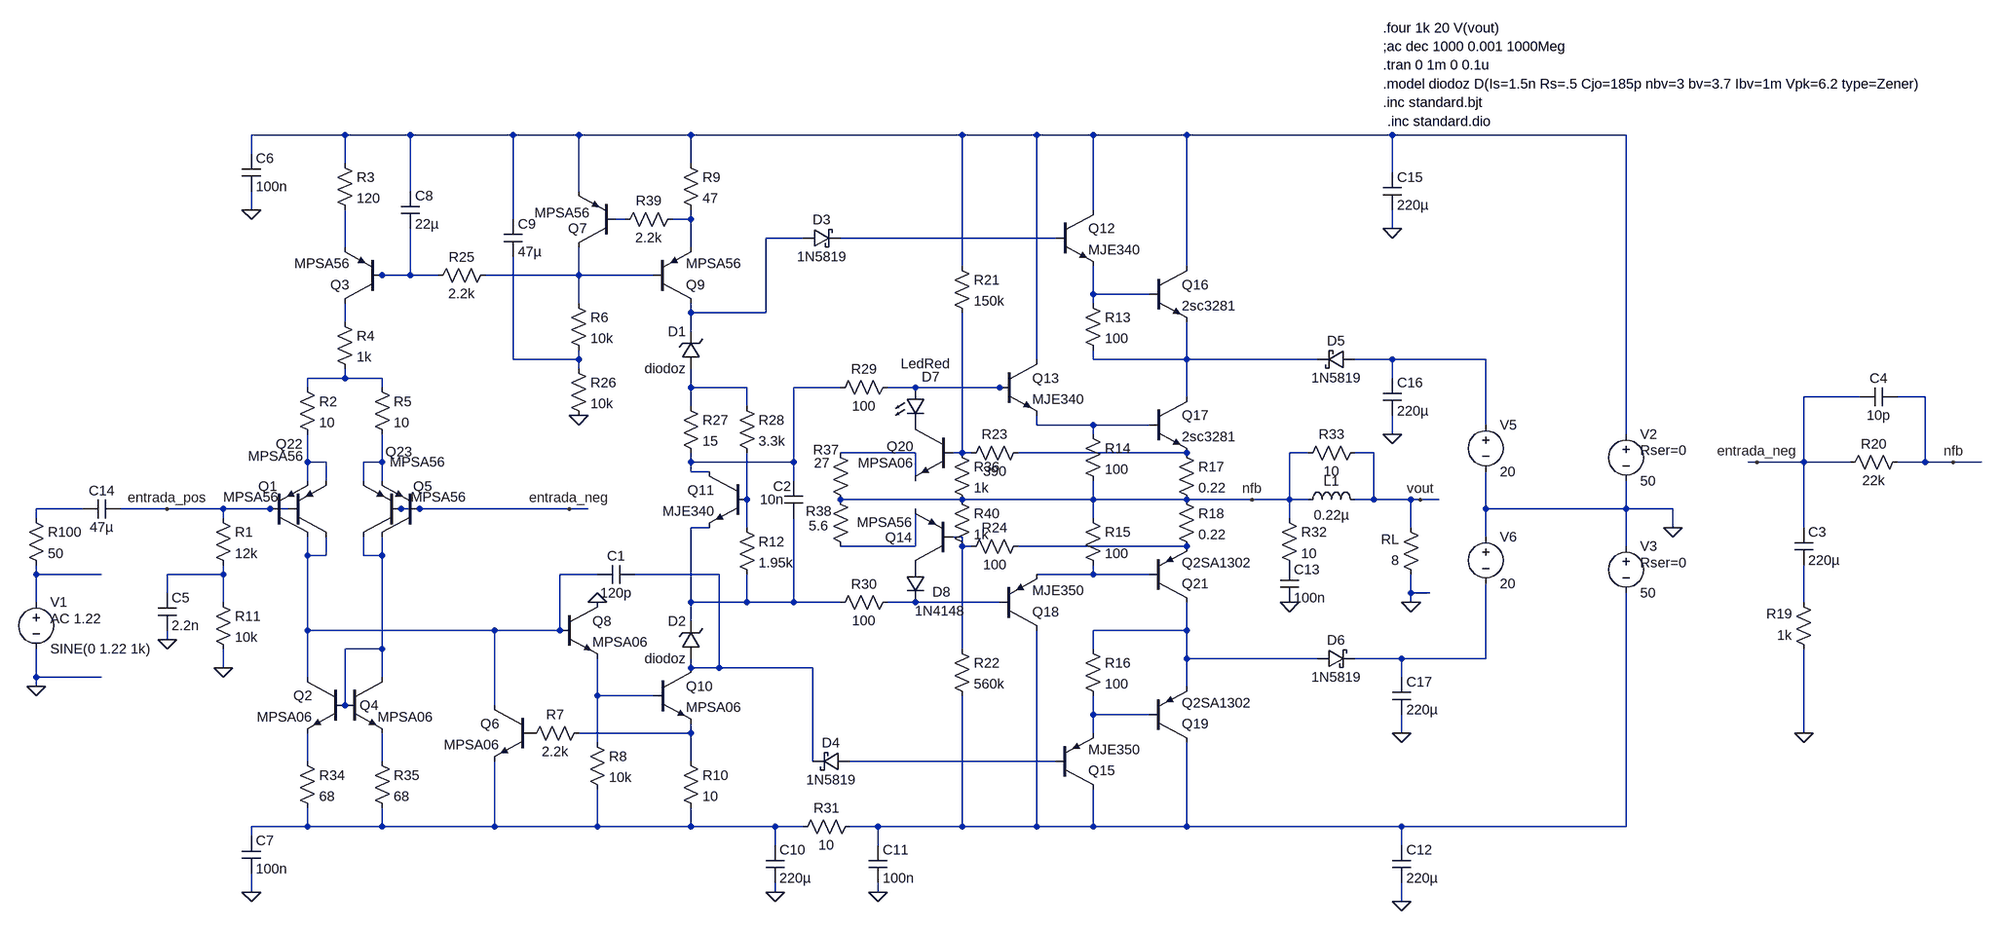
[diagram p0: schematic amplificador G - touch of fran.asc]
amplificador G - touch of fran.asc, the LTspice schematic file:
Version 4
SHEET 1 1412 756
WIRE -9488 -3552 -9648 -3552
WIRE -9376 -3552 -9488 -3552
WIRE -9200 -3552 -9376 -3552
WIRE -9088 -3552 -9200 -3552
WIRE -8896 -3552 -9088 -3552
WIRE -8432 -3552 -8896 -3552
WIRE -8304 -3552 -8432 -3552
WIRE -8208 -3552 -8304 -3552
WIRE -8048 -3552 -8208 -3552
WIRE -7696 -3552 -8048 -3552
WIRE -7296 -3552 -7696 -3552
WIRE -9648 -3520 -9648 -3552
WIRE -9488 -3504 -9488 -3552
WIRE -8896 -3504 -8896 -3552
WIRE -7696 -3488 -7696 -3552
WIRE -9376 -3456 -9376 -3552
WIRE -9088 -3456 -9088 -3552
WIRE -9648 -3424 -9648 -3456
WIRE -8208 -3424 -8208 -3552
WIRE -9200 -3408 -9200 -3552
WIRE -9008 -3408 -9024 -3408
WIRE -8896 -3408 -8896 -3424
WIRE -8896 -3408 -8928 -3408
WIRE -7696 -3392 -7696 -3424
WIRE -8704 -3376 -8768 -3376
WIRE -8272 -3376 -8640 -3376
WIRE -9488 -3360 -9488 -3424
WIRE -8896 -3360 -8896 -3408
WIRE -8432 -3328 -8432 -3552
WIRE -8048 -3328 -8048 -3552
WIRE -9424 -3312 -9440 -3312
WIRE -9376 -3312 -9376 -3392
WIRE -9376 -3312 -9424 -3312
WIRE -9328 -3312 -9376 -3312
WIRE -9088 -3312 -9088 -3360
WIRE -9088 -3312 -9248 -3312
WIRE -8960 -3312 -9088 -3312
WIRE -8208 -3280 -8208 -3328
WIRE -8112 -3280 -8208 -3280
WIRE -9088 -3264 -9088 -3312
WIRE -8208 -3264 -8208 -3280
WIRE -8896 -3248 -8896 -3264
WIRE -8768 -3248 -8768 -3376
WIRE -8768 -3248 -8896 -3248
WIRE -9488 -3232 -9488 -3264
WIRE -8896 -3216 -8896 -3248
WIRE -9200 -3168 -9200 -3344
WIRE -9088 -3168 -9088 -3184
WIRE -9088 -3168 -9200 -3168
WIRE -8304 -3168 -8304 -3552
WIRE -8208 -3168 -8208 -3184
WIRE -8048 -3168 -8048 -3232
WIRE -8048 -3168 -8208 -3168
WIRE -7824 -3168 -8048 -3168
WIRE -7696 -3168 -7760 -3168
WIRE -7536 -3168 -7696 -3168
WIRE -9088 -3152 -9088 -3168
WIRE -9488 -3136 -9488 -3152
WIRE -9488 -3136 -9552 -3136
WIRE -9424 -3136 -9488 -3136
WIRE -7696 -3136 -7696 -3168
WIRE -9552 -3120 -9552 -3136
WIRE -9424 -3120 -9424 -3136
WIRE -8896 -3120 -8896 -3152
WIRE -8800 -3120 -8896 -3120
WIRE -8640 -3120 -8720 -3120
WIRE -8512 -3120 -8560 -3120
WIRE -8368 -3120 -8512 -3120
WIRE -8352 -3120 -8368 -3120
WIRE -8048 -3104 -8048 -3168
WIRE -6896 -3104 -6992 -3104
WIRE -6784 -3104 -6832 -3104
WIRE -8896 -3088 -8896 -3120
WIRE -8800 -3088 -8800 -3120
WIRE -8304 -3056 -8304 -3072
WIRE -8208 -3056 -8304 -3056
WIRE -8112 -3056 -8208 -3056
WIRE -7536 -3056 -7536 -3168
WIRE -8208 -3040 -8208 -3056
WIRE -7696 -3040 -7696 -3072
WIRE -7296 -3040 -7296 -3552
WIRE -8512 -3008 -8640 -3008
WIRE -8432 -3008 -8432 -3248
WIRE -8432 -3008 -8448 -3008
WIRE -8416 -3008 -8432 -3008
WIRE -8048 -3008 -8336 -3008
WIRE -7840 -3008 -7872 -3008
WIRE -7728 -3008 -7760 -3008
WIRE -9552 -2992 -9552 -3040
WIRE -9520 -2992 -9552 -2992
WIRE -9424 -2992 -9424 -3040
WIRE -9424 -2992 -9456 -2992
WIRE -8896 -2992 -8896 -3008
WIRE -8720 -2992 -8720 -3120
WIRE -8720 -2992 -8896 -2992
WIRE -7072 -2992 -7088 -2992
WIRE -6992 -2992 -6992 -3104
WIRE -6992 -2992 -7072 -2992
WIRE -6912 -2992 -6992 -2992
WIRE -6784 -2992 -6784 -3104
WIRE -6784 -2992 -6832 -2992
WIRE -6736 -2992 -6784 -2992
WIRE -6688 -2992 -6736 -2992
WIRE -8896 -2976 -8896 -2992
WIRE -8864 -2976 -8896 -2976
WIRE -9552 -2960 -9552 -2992
WIRE -9520 -2960 -9520 -2992
WIRE -9456 -2960 -9456 -2992
WIRE -9424 -2960 -9424 -2992
WIRE -8720 -2960 -8720 -2992
WIRE -8512 -2960 -8512 -3008
WIRE -8800 -2928 -8800 -3008
WIRE -8432 -2928 -8640 -2928
WIRE -8208 -2928 -8208 -2960
WIRE -8208 -2928 -8432 -2928
WIRE -8048 -2928 -8208 -2928
WIRE -7936 -2928 -8048 -2928
WIRE -7872 -2928 -7872 -3008
WIRE -7872 -2928 -7936 -2928
WIRE -7840 -2928 -7872 -2928
WIRE -7728 -2928 -7728 -3008
WIRE -7728 -2928 -7760 -2928
WIRE -7664 -2928 -7728 -2928
WIRE -7648 -2928 -7664 -2928
WIRE -7616 -2928 -7648 -2928
WIRE -9936 -2912 -10016 -2912
WIRE -9792 -2912 -9872 -2912
WIRE -9696 -2912 -9792 -2912
WIRE -9616 -2912 -9696 -2912
WIRE -9584 -2912 -9616 -2912
WIRE -9392 -2912 -9408 -2912
WIRE -9360 -2912 -9392 -2912
WIRE -9104 -2912 -9360 -2912
WIRE -9072 -2912 -9104 -2912
WIRE -7536 -2912 -7536 -2976
WIRE -7296 -2912 -7296 -2960
WIRE -7296 -2912 -7536 -2912
WIRE -7216 -2912 -7296 -2912
WIRE -10016 -2896 -10016 -2912
WIRE -9696 -2896 -9696 -2912
WIRE -8208 -2896 -8208 -2928
WIRE -7872 -2896 -7872 -2928
WIRE -8864 -2880 -8896 -2880
WIRE -8800 -2880 -8800 -2928
WIRE -7664 -2880 -7664 -2928
WIRE -7216 -2880 -7216 -2912
WIRE -6992 -2880 -6992 -2992
WIRE -8432 -2864 -8448 -2864
WIRE -7536 -2864 -7536 -2912
WIRE -8512 -2848 -8512 -2912
WIRE -8512 -2848 -8640 -2848
WIRE -8432 -2848 -8432 -2864
WIRE -8416 -2848 -8432 -2848
WIRE -8048 -2848 -8336 -2848
WIRE -7296 -2848 -7296 -2912
WIRE -9552 -2832 -9552 -2864
WIRE -9520 -2832 -9520 -2864
WIRE -9520 -2832 -9552 -2832
WIRE -9456 -2832 -9456 -2864
WIRE -9424 -2832 -9424 -2864
WIRE -9424 -2832 -9456 -2832
WIRE -10016 -2800 -10016 -2816
WIRE -9904 -2800 -10016 -2800
WIRE -9696 -2800 -9696 -2816
WIRE -9696 -2800 -9792 -2800
WIRE -9056 -2800 -9120 -2800
WIRE -8848 -2800 -8992 -2800
WIRE -8208 -2800 -8208 -2816
WIRE -8208 -2800 -8304 -2800
WIRE -8112 -2800 -8208 -2800
WIRE -9792 -2768 -9792 -2800
WIRE -7664 -2768 -7664 -2800
WIRE -7632 -2768 -7664 -2768
WIRE -10016 -2752 -10016 -2800
WIRE -9696 -2752 -9696 -2800
WIRE -8896 -2752 -8896 -2880
WIRE -8800 -2752 -8800 -2800
WIRE -8800 -2752 -8896 -2752
WIRE -8720 -2752 -8720 -2896
WIRE -8720 -2752 -8800 -2752
WIRE -8640 -2752 -8720 -2752
WIRE -8512 -2752 -8560 -2752
WIRE -8368 -2752 -8512 -2752
WIRE -7664 -2752 -7664 -2768
WIRE -6992 -2752 -6992 -2816
WIRE -8896 -2720 -8896 -2752
WIRE -9552 -2704 -9552 -2832
WIRE -9232 -2704 -9552 -2704
WIRE -9120 -2704 -9120 -2800
WIRE -9120 -2704 -9232 -2704
WIRE -8048 -2704 -8048 -2752
WIRE -8048 -2704 -8208 -2704
WIRE -9792 -2688 -9792 -2704
WIRE -9424 -2672 -9424 -2832
WIRE -9424 -2672 -9488 -2672
WIRE -8432 -2672 -8432 -2848
WIRE -8208 -2672 -8208 -2704
WIRE -8048 -2656 -8048 -2704
WIRE -7824 -2656 -8048 -2656
WIRE -7680 -2656 -7760 -2656
WIRE -7536 -2656 -7536 -2784
WIRE -7536 -2656 -7680 -2656
WIRE -9696 -2640 -9696 -2672
WIRE -8896 -2640 -8896 -2656
WIRE -8848 -2640 -8848 -2800
WIRE -8848 -2640 -8896 -2640
WIRE -8688 -2640 -8848 -2640
WIRE -10016 -2624 -10016 -2672
WIRE -9904 -2624 -10016 -2624
WIRE -9552 -2624 -9552 -2704
WIRE -9424 -2624 -9424 -2672
WIRE -7680 -2624 -7680 -2656
WIRE -10016 -2608 -10016 -2624
WIRE -8048 -2608 -8048 -2656
WIRE -9056 -2592 -9056 -2656
WIRE -8960 -2592 -9056 -2592
WIRE -9488 -2576 -9488 -2672
WIRE -9232 -2576 -9232 -2704
WIRE -8208 -2560 -8208 -2592
WIRE -8112 -2560 -8208 -2560
WIRE -8896 -2528 -8896 -2544
WIRE -8896 -2528 -9088 -2528
WIRE -8208 -2528 -8208 -2560
WIRE -7680 -2528 -7680 -2560
WIRE -6992 -2528 -6992 -2672
WIRE -9056 -2512 -9056 -2592
WIRE -9552 -2480 -9552 -2528
WIRE -9424 -2480 -9424 -2528
WIRE -8896 -2480 -8896 -2528
WIRE -8688 -2480 -8688 -2640
WIRE -8272 -2480 -8624 -2480
WIRE -9552 -2368 -9552 -2400
WIRE -9552 -2368 -9648 -2368
WIRE -9424 -2368 -9424 -2400
WIRE -9424 -2368 -9552 -2368
WIRE -9232 -2368 -9232 -2480
WIRE -9232 -2368 -9424 -2368
WIRE -9056 -2368 -9056 -2432
WIRE -9056 -2368 -9232 -2368
WIRE -8896 -2368 -8896 -2400
WIRE -8896 -2368 -9056 -2368
WIRE -8752 -2368 -8896 -2368
WIRE -8704 -2368 -8752 -2368
WIRE -8576 -2368 -8624 -2368
WIRE -8432 -2368 -8432 -2592
WIRE -8432 -2368 -8576 -2368
WIRE -8304 -2368 -8304 -2704
WIRE -8304 -2368 -8432 -2368
WIRE -8208 -2368 -8208 -2432
WIRE -8208 -2368 -8304 -2368
WIRE -8048 -2368 -8048 -2512
WIRE -8048 -2368 -8208 -2368
WIRE -7680 -2368 -8048 -2368
WIRE -7296 -2368 -7296 -2768
WIRE -7296 -2368 -7680 -2368
WIRE -9648 -2352 -9648 -2368
WIRE -8752 -2336 -8752 -2368
WIRE -8576 -2336 -8576 -2368
WIRE -7680 -2336 -7680 -2368
WIRE -9648 -2256 -9648 -2288
WIRE -8752 -2256 -8752 -2272
WIRE -8576 -2256 -8576 -2272
WIRE -7680 -2240 -7680 -2272
FLAG -7216 -2880 0
FLAG -9696 -2640 0
FLAG -7664 -2752 0
FLAG -7936 -2928 nfb
FLAG -10016 -2608 0
FLAG -6992 -2528 0
FLAG -7072 -2992 entrada_neg
FLAG -9104 -2912 entrada_neg
FLAG -6736 -2992 nfb
FLAG -9792 -2912 entrada_pos
FLAG -9056 -2752 0
FLAG -9088 -3072 0
FLAG -9648 -3424 0
FLAG -7696 -3392 0
FLAG -7872 -2752 0
FLAG -8752 -2256 0
FLAG -8576 -2256 0
FLAG -9648 -2256 0
FLAG -7680 -2240 0
FLAG -7680 -2528 0
FLAG -7696 -3040 0
FLAG -9792 -2688 0
FLAG -7648 -2928 vout
SYMBOL res -9504 -3520 R0
SYMATTR InstName R3
SYMATTR Value 120
SYMBOL res -8912 -2496 R0
SYMATTR InstName R10
SYMATTR Value 10
SYMBOL res -8912 -3520 R0
SYMATTR InstName R9
SYMATTR Value 47
SYMBOL res -6816 -3008 R90
WINDOW 0 0 56 VBottom 2
WINDOW 3 32 56 VTop 2
SYMATTR InstName R20
SYMATTR Value 22k
SYMBOL res -6976 -2656 R180
WINDOW 0 36 76 Left 2
WINDOW 3 36 40 Left 2
SYMATTR InstName R19
SYMATTR Value 1k
SYMBOL res -7648 -2784 R180
WINDOW 0 36 76 Left 2
WINDOW 3 36 40 Left 2
SYMATTR InstName RL
SYMATTR Value 8
SYMBOL voltage -7296 -3056 R0
WINDOW 123 0 0 Left 2
WINDOW 39 24 44 Left 2
SYMATTR SpiceLine Rser=0
SYMATTR InstName V2
SYMATTR Value 50
SYMBOL voltage -7296 -2864 R0
WINDOW 123 0 0 Left 2
WINDOW 39 24 44 Left 2
SYMATTR SpiceLine Rser=0
SYMATTR InstName V3
SYMATTR Value 50
SYMBOL pnp -9360 -2864 R180
WINDOW 0 -21 87 Left 2
WINDOW 3 -79 68 Left 2
SYMATTR InstName Q5
SYMATTR Value MPSA56
SYMBOL pnp -9616 -2864 M180
WINDOW 0 -20 87 Left 2
WINDOW 3 -80 68 Left 2
SYMATTR InstName Q1
SYMATTR Value MPSA56
SYMBOL npn -8960 -2640 R0
SYMATTR InstName Q10
SYMATTR Value MPSA06
SYMBOL npn -8368 -3168 R0
SYMATTR InstName Q13
SYMATTR Value MJE340
SYMBOL cap -7008 -2880 R0
SYMATTR InstName C3
SYMATTR Value 220µ
SYMBOL pnp -8368 -2704 M180
SYMATTR InstName Q18
SYMATTR Value MJE350
SYMBOL npn -8800 -2976 M0
SYMATTR InstName Q11
SYMATTR Value MJE340
SYMBOL res -8816 -3104 R0
SYMATTR Value 3.3k
SYMATTR InstName R28
SYMBOL res -8816 -2896 R0
SYMATTR InstName R12
SYMATTR Value 1.95k
SYMBOL cap -8736 -2960 R0
WINDOW 0 -19 9 Left 2
WINDOW 3 -42 32 Left 2
SYMATTR InstName C2
SYMATTR Value 10n
SYMBOL voltage -10016 -2768 R0
WINDOW 123 24 44 Left 2
WINDOW 39 0 0 Left 2
SYMATTR Value2 AC 1.22
SYMATTR InstName V1
SYMATTR Value SINE(0 1.22 1k)
SYMBOL res -10032 -2912 R0
SYMATTR InstName R100
SYMATTR Value 50
SYMBOL cap -9872 -2928 R90
WINDOW 0 0 32 VBottom 2
WINDOW 3 32 32 VTop 2
SYMATTR InstName C14
SYMATTR Value 47µ
SYMBOL npn -8112 -3104 R0
SYMATTR InstName Q17
SYMATTR Value 2sc3281
SYMBOL pnp -8112 -2752 M180
SYMATTR InstName Q21
SYMATTR Value Q2SA1302
SYMBOL res -8224 -3056 R0
SYMATTR InstName R14
SYMATTR Value 100
SYMBOL res -8224 -2912 R0
SYMATTR InstName R15
SYMATTR Value 100
SYMBOL npn -9488 -2624 R0
WINDOW 0 25 48 Left 2
SYMATTR InstName Q4
SYMATTR Value MPSA06
SYMBOL npn -9488 -2624 M0
SYMATTR InstName Q2
SYMATTR Value MPSA06
SYMBOL pnp -8960 -3264 M180
SYMATTR InstName Q9
SYMATTR Value MPSA56
SYMBOL pnp -9424 -3264 R180
SYMATTR InstName Q3
SYMATTR Value MPSA56
SYMBOL pnp -8272 -2432 M180
SYMATTR InstName Q15
SYMATTR Value MJE350
SYMBOL npn -8272 -3424 R0
SYMATTR InstName Q12
SYMATTR Value MJE340
SYMBOL npn -8112 -3328 R0
SYMATTR InstName Q16
SYMATTR Value 2sc3281
SYMBOL res -8224 -3280 R0
SYMATTR InstName R13
SYMATTR Value 100
SYMBOL res -8224 -2688 R0
SYMATTR InstName R16
SYMATTR Value 100
SYMBOL zener -8880 -3152 R180
WINDOW 0 24 64 Left 2
WINDOW 3 24 0 Left 2
SYMATTR InstName D1
SYMATTR Value diodoz
SYMBOL zener -8880 -2656 R180
WINDOW 0 24 64 Left 2
WINDOW 3 24 0 Left 2
SYMATTR InstName D2
SYMATTR Value diodoz
SYMBOL schottky -7760 -3184 R90
WINDOW 0 0 32 VBottom 2
WINDOW 3 32 32 VTop 2
SYMATTR InstName D5
SYMATTR Value 1N5819
SYMBOL schottky -7824 -2640 R270
WINDOW 0 32 32 VTop 2
WINDOW 3 0 32 VBottom 2
SYMATTR InstName D6
SYMATTR Value 1N5819
SYMBOL voltage -7536 -3072 R0
WINDOW 123 0 0 Left 2
WINDOW 39 0 0 Left 2
SYMATTR InstName V5
SYMATTR Value 20
SYMBOL voltage -7536 -2880 R0
WINDOW 123 0 0 Left 2
WINDOW 39 0 0 Left 2
SYMATTR InstName V6
SYMATTR Value 20
SYMBOL npn -9120 -2752 R0
SYMATTR InstName Q8
SYMATTR Value MPSA06
SYMBOL res -9104 -3280 R0
SYMATTR InstName R6
SYMATTR Value 10k
SYMBOL res -8064 -3024 R0
SYMATTR InstName R17
SYMATTR Value 0.22
SYMBOL res -8064 -2944 R0
SYMATTR InstName R18
SYMATTR Value 0.22
SYMBOL res -9568 -3136 R0
SYMATTR InstName R2
SYMATTR Value 10
SYMBOL res -9440 -3136 R0
SYMATTR InstName R5
SYMATTR Value 10
SYMBOL res -9504 -3248 R0
SYMATTR InstName R4
SYMATTR Value 1k
SYMBOL cap -8992 -2816 R90
WINDOW 0 0 32 VBottom 2
WINDOW 3 32 32 VTop 2
SYMATTR InstName C1
SYMATTR Value 120p
SYMBOL res -9072 -2528 R0
SYMATTR InstName R8
SYMATTR Value 10k
SYMBOL cap -6832 -3120 R90
WINDOW 0 0 32 VBottom 2
WINDOW 3 32 32 VTop 2
SYMATTR InstName C4
SYMATTR Value 10p
SYMBOL schottky -8624 -2496 R90
WINDOW 0 0 32 VBottom 2
WINDOW 3 32 32 VTop 2
SYMATTR InstName D4
SYMATTR Value 1N5819
SYMBOL schottky -8704 -3360 R270
WINDOW 0 32 32 VTop 2
WINDOW 3 0 32 VBottom 2
SYMATTR InstName D3
SYMATTR Value 1N5819
SYMBOL npn -8448 -3056 M0
WINDOW 0 67 37 Left 2
WINDOW 3 68 65 Left 2
SYMATTR InstName Q20
SYMATTR Value MPSA06
SYMBOL pnp -8448 -2816 R180
WINDOW 3 69 73 Left 2
WINDOW 0 70 47 Left 2
SYMATTR Value MPSA56
SYMATTR InstName Q14
SYMBOL res -8448 -3344 R0
SYMATTR InstName R21
SYMATTR Value 150k
SYMBOL res -8448 -2688 R0
SYMATTR InstName R22
SYMATTR Value 560k
SYMBOL res -8320 -3024 R90
WINDOW 0 0 56 VBottom 2
WINDOW 3 32 56 VTop 2
SYMATTR InstName R23
SYMATTR Value 390
SYMBOL res -8320 -2864 R90
WINDOW 0 0 56 VBottom 2
WINDOW 3 32 56 VTop 2
SYMATTR InstName R24
SYMATTR Value 100
SYMBOL LED -8528 -3120 R0
WINDOW 0 27 -18 Left 2
WINDOW 3 -9 -41 Left 2
SYMATTR InstName D7
SYMATTR Value LedRed
SYMATTR Description Diode
SYMATTR Type diode
SYMBOL diode -8528 -2816 R0
WINDOW 0 45 46 Left 2
WINDOW 3 15 79 Left 2
SYMATTR InstName D8
SYMATTR Value 1N4148
SYMBOL res -8544 -3136 R90
WINDOW 0 0 56 VBottom 2
WINDOW 3 32 56 VTop 2
SYMATTR InstName R29
SYMATTR Value 100
SYMBOL res -8544 -2768 R90
WINDOW 0 0 56 VBottom 2
WINDOW 3 32 56 VTop 2
SYMATTR InstName R30
SYMATTR Value 100
SYMBOL res -8912 -3104 R0
SYMATTR InstName R27
SYMATTR Value 15
SYMBOL res -9568 -2496 R0
SYMATTR InstName R34
SYMATTR Value 68
SYMBOL res -9440 -2496 R0
SYMATTR InstName R35
SYMATTR Value 68
SYMBOL npn -9168 -2576 M0
SYMATTR InstName Q6
SYMATTR Value MPSA06
SYMBOL res -9072 -2544 R90
WINDOW 0 0 56 VBottom 2
WINDOW 3 32 56 VTop 2
SYMATTR InstName R7
SYMATTR Value 2.2k
SYMBOL cap -9392 -3456 R0
SYMATTR InstName C8
SYMATTR Value 22µ
SYMBOL pnp -9024 -3360 R180
WINDOW 0 50 32 Left 2
WINDOW 3 45 59 Left 2
SYMATTR InstName Q7
SYMATTR Value MPSA56
SYMBOL res -8912 -3424 R90
WINDOW 0 0 56 VBottom 2
WINDOW 3 32 56 VTop 2
SYMATTR InstName R39
SYMATTR Value 2.2k
SYMBOL pnp -8112 -2512 M180
SYMATTR InstName Q19
SYMATTR Value Q2SA1302
SYMBOL res -9104 -3168 R0
SYMATTR InstName R26
SYMATTR Value 10k
SYMBOL cap -9216 -3408 R0
SYMATTR InstName C9
SYMATTR Value 47µ
SYMBOL cap -9664 -3520 R0
SYMATTR InstName C6
SYMATTR Value 100n
SYMBOL cap -7712 -3488 R0
SYMATTR InstName C15
SYMATTR Value 220µ
SYMBOL res -7888 -2912 R0
SYMATTR InstName R32
SYMATTR Value 10
SYMBOL cap -7888 -2816 R0
SYMATTR InstName C13
SYMATTR Value 100n
SYMBOL ind -7856 -2912 R270
WINDOW 0 32 56 VTop 2
WINDOW 3 5 56 VBottom 2
SYMATTR InstName L1
SYMATTR Value 0.22µ
SYMBOL res -7856 -2992 R270
WINDOW 0 32 56 VTop 2
WINDOW 3 0 56 VBottom 2
SYMATTR InstName R33
SYMATTR Value 10
SYMBOL cap -8592 -2336 R0
SYMATTR InstName C11
SYMATTR Value 100n
SYMBOL cap -8768 -2336 R0
SYMATTR InstName C10
SYMATTR Value 220µ
SYMBOL res -8608 -2384 R90
WINDOW 0 0 56 VBottom 2
WINDOW 3 32 56 VTop 2
SYMATTR InstName R31
SYMATTR Value 10
SYMBOL cap -9664 -2352 R0
SYMATTR InstName C7
SYMATTR Value 100n
SYMBOL cap -7712 -3136 R0
SYMATTR InstName C16
SYMATTR Value 220µ
SYMBOL cap -7696 -2624 R0
SYMATTR InstName C17
SYMATTR Value 220µ
SYMBOL cap -7696 -2336 R0
SYMATTR InstName C12
SYMATTR Value 220µ
SYMBOL res -9712 -2912 R0
SYMATTR InstName R1
SYMATTR Value 12k
SYMBOL res -9712 -2768 R0
SYMATTR InstName R11
SYMATTR Value 10k
SYMBOL cap -9808 -2768 R0
SYMATTR InstName C5
SYMATTR Value 2.2n
SYMBOL pnp -9392 -2864 R180
WINDOW 0 -19 146 Left 2
WINDOW 3 167 138 Left 2
SYMATTR InstName Q23
SYMATTR Value MPSA56
SYMBOL pnp -9584 -2864 M180
WINDOW 0 -22 159 Left 2
WINDOW 3 173 128 Left 2
SYMATTR InstName Q22
SYMATTR Value MPSA56
SYMBOL res -9232 -3328 R90
WINDOW 0 0 56 VBottom 2
WINDOW 3 32 56 VTop 2
SYMATTR InstName R25
SYMATTR Value 2.2k
SYMBOL res -8656 -3024 R0
WINDOW 0 -31 11 Left 2
WINDOW 3 -29 33 Left 2
SYMATTR InstName R37
SYMATTR Value 27
SYMBOL res -8656 -2944 R0
WINDOW 0 -43 36 Left 2
WINDOW 3 -38 61 Left 2
SYMATTR InstName R38
SYMATTR Value 5.6
SYMBOL res -8448 -3024 R0
SYMATTR InstName R36
SYMATTR Value 1k
SYMBOL res -8448 -2944 R0
SYMATTR InstName R40
SYMATTR Value 1k
TEXT -7712 -3672 Left 2 !.tran 0 1m 0 0.1u
TEXT -7712 -3704 Left 2 !;ac dec 1000 0.001 1000Meg
TEXT -7712 -3736 Left 2 !.four 1k 20 V(vout)
TEXT -7712 -3640 Left 2 !.model diodoz D(Is=1.5n Rs=.5 Cjo=185p nbv=3 bv=3.7 Ibv=1m Vpk=6.2 type=Zener)
TEXT -7712 -3608 Left 2 !.inc standard.bjt
TEXT -7704 -3576 Left 2 !.inc standard.dio

The netlist it stands for:
* amplificador G - touch of fran.asc
R3 N001 N006 120
R10 N042 N046 10
R9 N001 N003 47
R20 nfb entrada_neg 22k
R19 0 N037 1k
RL 0 vout 8
V2 N001 0 50 Rser=0
V3 0 N047 50 Rser=0
Q5 N031 entrada_neg N023 0 MPSA56
Q1 N030 entrada_pos N022 0 MPSA56
Q10 N034 N040 N042 0 MPSA06
Q13 N001 N017 N018 0 MJE340
C3 entrada_neg N037 220µ
Q18 N047 N036 N035 0 MJE350
Q11 N016 N024 N026 0 MJE340
R28 N015 N024 3.3k
R12 N024 N026 1.95k
C2 N016 N026 10n
V1 N032 0 SINE(0 1.22 1k) AC 1.22
R100 N025 N032 50
C14 entrada_pos N025 47µ
Q17 N012 N018 N021 0 2sc3281
Q21 N038 N035 N029 0 Q2SA1302
R14 N018 nfb 100
R15 nfb N035 100
Q4 N031 N031 N044 0 MPSA06
Q2 N030 N031 N043 0 MPSA06
Q9 N004 N008 N003 0 MPSA56
Q3 N010 N007 N006 0 MPSA56
Q15 N047 N045 N041 0 MJE350
Q12 N001 N005 N009 0 MJE340
Q16 N001 N009 N012 0 2sc3281
R13 N009 N012 100
R16 N038 N041 100
D1 N015 N004 diodoz
D2 N034 N026 diodoz
D5 N013 N012 1N5819
D6 N038 N039 1N5819
V5 N013 0 20
V6 0 N039 20
Q8 0 N030 N040 0 MPSA06
R6 N008 N011 10k
R17 N021 nfb 0.22
R18 nfb N029 0.22
R2 N014 N022 10
R5 N014 N023 10
R4 N010 N014 1k
C1 N034 N030 120p
R8 N040 N046 10k
C4 nfb entrada_neg 10p
D4 N045 N034 1N5819
D3 N004 N005 1N5819
Q20 P001 N020 N019 0 MPSA06
Q14 P002 N027 N028 0 MPSA56
R21 N001 N020 150k
R22 N027 N047 560k
R23 N021 N020 390
R24 N029 N027 100
D7 N017 P001 LedRed
D8 P002 N036 1N4148
R29 N017 N016 100
R30 N036 N026 100
R27 N015 N016 15
R34 N043 N046 68
R35 N044 N046 68
Q6 N030 P003 N046 0 MPSA06
R7 N042 P003 2.2k
C8 N001 N007 22µ
Q7 N008 N002 N001 0 MPSA56
R39 N003 N002 2.2k
Q19 N047 N041 N038 0 Q2SA1302
R26 N011 0 10k
C9 N001 N011 47µ
C6 N001 0 100n
C15 N001 0 220µ
R32 nfb P004 10
C13 P004 0 100n
L1 nfb vout 0.22µ
R33 nfb vout 10
C11 N047 0 100n
C10 N046 0 220µ
R31 N047 N046 10
C7 N046 0 100n
C16 N013 0 220µ
C17 N039 0 220µ
C12 N047 0 220µ
R1 entrada_pos N033 12k
R11 N033 0 10k
C5 N033 0 2.2n
Q23 N031 entrada_neg N023 0 MPSA56
Q22 N030 entrada_pos N022 0 MPSA56
R25 N008 N007 2.2k
R37 N019 nfb 27
R38 nfb N028 5.6
R36 N020 nfb 1k
R40 nfb N027 1k
.model D D
.lib standard.dio
.model NPN NPN
.model PNP PNP
.lib standard.bjt
.tran 0 1m 0 0.1u
;ac dec 1000 0.001 1000Meg
.four 1k 20 V(vout)
.model diodoz D(Is=1.5n Rs=.5 Cjo=185p nbv=3 bv=3.7 Ibv=1m Vpk=6.2 type=Zener)
.inc standard.bjt
.inc standard.dio
.backanno
.end